# Altium schematic sheet HV-A-4.SchDoc
size A4
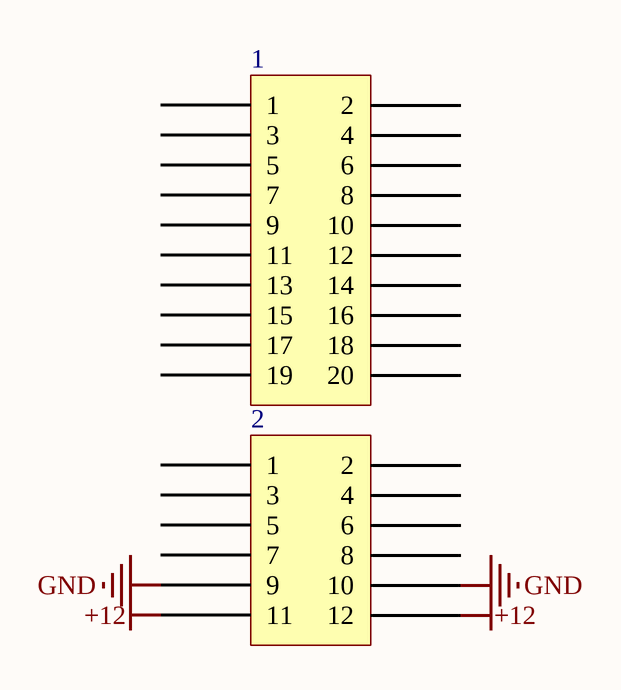
[diagram p0: HV-A-4.SchDoc]

## Parts
1  BTB-805-20P  [BTB-805-20P]  (value not drawn)
2  BTB-805-12P  [BTB-805-12P]  (value not drawn)

## Nets
+12: 2.11 2.12
GND: 2.9 2.10

Not connected (* = marked no-connect by the designer): 1 1 2 3 4 5 6 7 8 9 10 11 12 13 14 15 16 17 18 19 20; 2 1 2 3 4 5 6 7 8